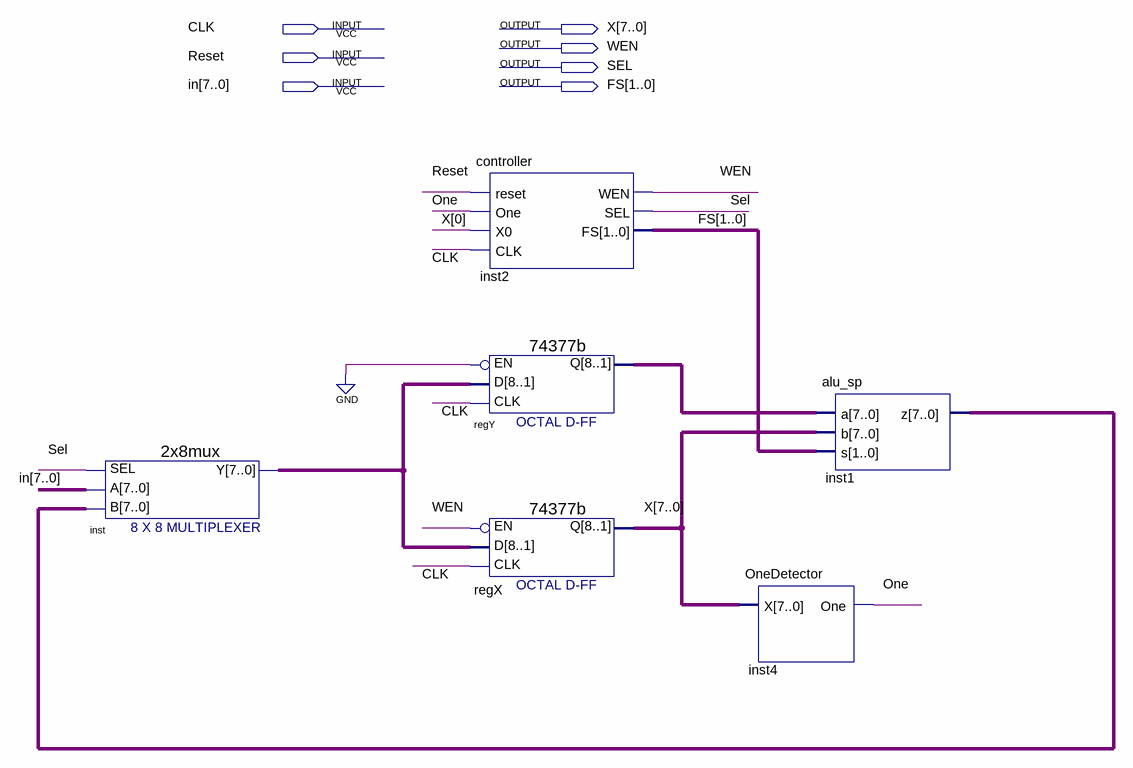
[diagram p0: schematic sheet]
// Quartus schematic UlamSim.bdf as structural Verilog: 6 symbols, 7 pins
module UlamSim (
  input  CLK,
  input  Reset,
  input  [7:0] in,
  output [7:0] X,
  output WEN,
  output SEL,
  output [1:0] FS
);

  wire One;
  wire [7:0] inst1_z, inst_y, regY_q;

  \2x8mux  inst (.SEL(SEL), .A(in), .B(inst1_z), .Y(inst_y));
  controller inst2 (.reset(Reset), .One(One), .X0(X[0]), .CLK(CLK), .WEN(WEN), .SEL(SEL), .FS(FS));
  \74377b  regY (.CLK(CLK), .EN(1'b0), .D(inst_y), .Q(regY_q));
  \74377b  regX (.CLK(CLK), .EN(WEN), .D(inst_y), .Q(X));
  OneDetector inst4 (.X(X), .One(One));
  alu_sp inst1 (.a(regY_q), .b(X), .s(FS), .z(inst1_z));
endmodule
